# Altium project vesc.PrjPcb
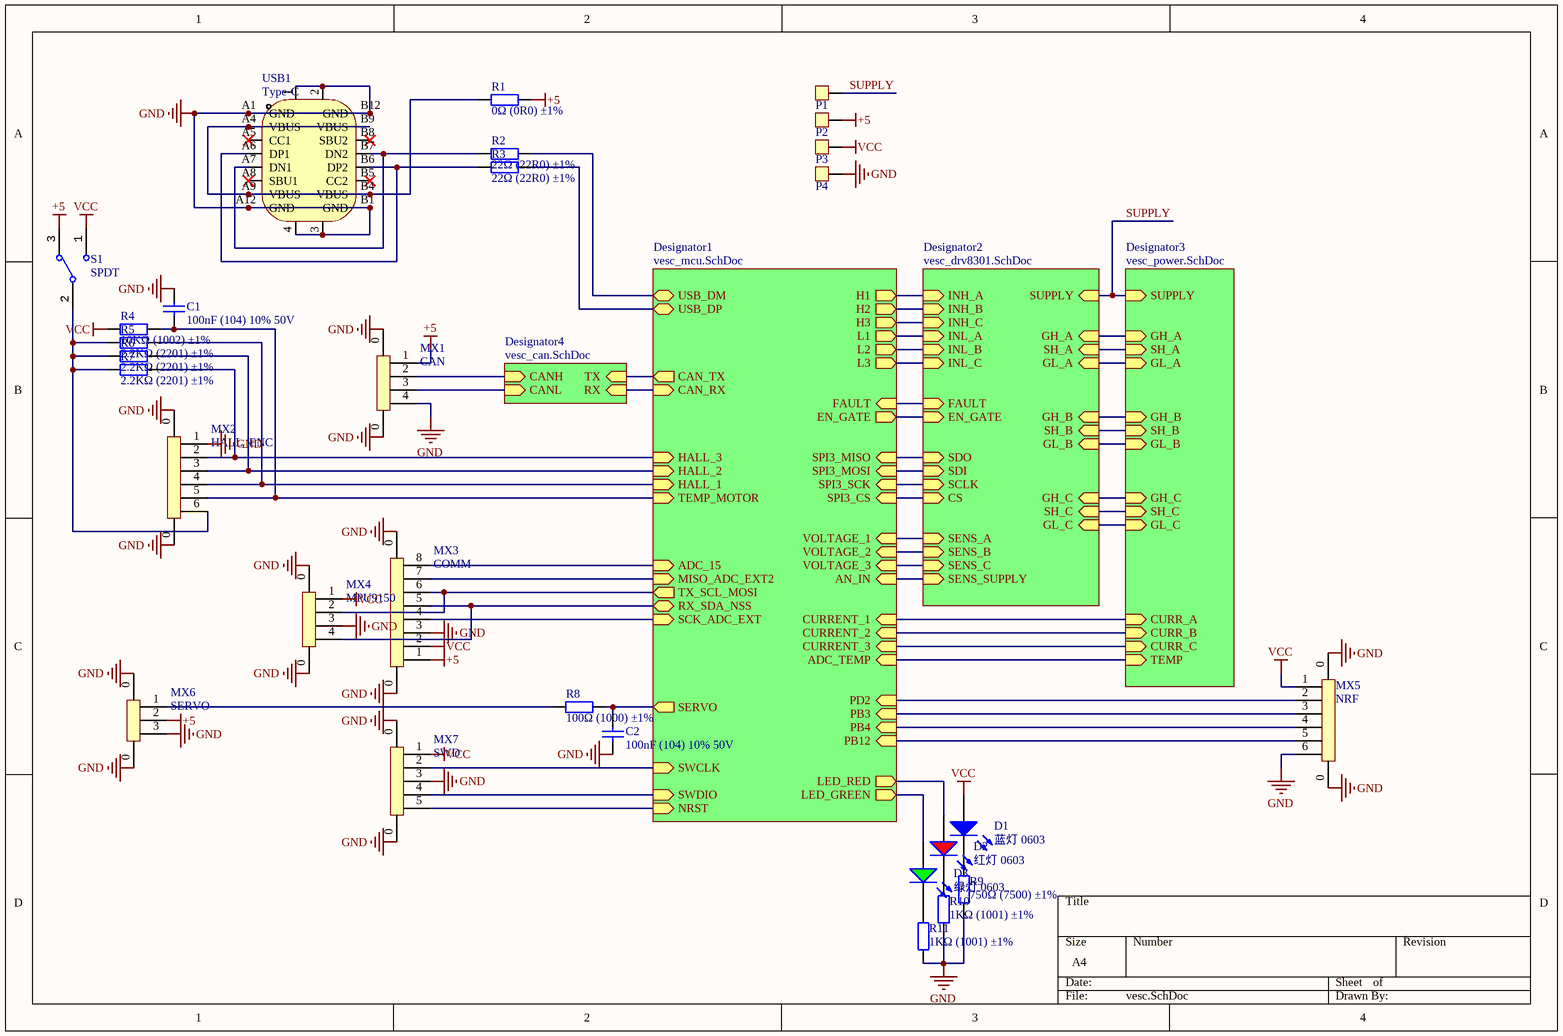
[diagram p0: vesc.SchDoc]
5 sheets, 127 parts. Net scope: hierarchical (ports join the sheet entries above them; power ports are global).
Board file: vesc.PcbDoc
Sheets:
  vesc.SchDoc
    Designator4 = vesc_can.SchDoc
    Designator1 = vesc_mcu.SchDoc
    Designator2 = vesc_drv8301.SchDoc
    Designator3 = vesc_power.SchDoc

## Sheet vesc.SchDoc
size A4; SheetNumber: 1; SheetTotal: 5

### Parts
C1  100nF (104) 10% 50V  [0603_C]
C2  100nF (104) 10% 50V  [0603_C]
D1  蓝灯 0603  [0603_LED_S1]
D2  红灯 0603  [0603_LED_S1]
D3  绿灯 0603  [0603_LED_S1]
MX1  CAN  [MX 1.25-WS-4P]
MX2  HALL_ENC  [MX 1.25-WS-6P]
MX3  COMM  [MX 1.25-WS-8P]
MX4  MPU9150  [MX 1.25-WS-4P]
MX5  NRF  [MX 1.25-WS-6P]
MX6  SERVO  [MX 1.25-WS-3P]
MX7  SWD  [MX 1.25-WS-5P]
P1  PAD  [PAD]  (value not drawn)
P2  PAD  [PAD]  (value not drawn)
P3  PAD  [PAD]  (value not drawn)
P4  PAD  [PAD]  (value not drawn)
R1  0Ω (0R0) ±1%  [0603_R]
R2  22Ω (22R0) ±1%  [0603_R]
R3  22Ω (22R0) ±1%  [0603_R]
R4  10KΩ (1002) ±1%  [0603_R]
R5  2.2KΩ (2201) ±1%  [0603_R]
R6  2.2KΩ (2201) ±1%  [0603_R]
R7  2.2KΩ (2201) ±1%  [0603_R]
R8  100Ω (1000) ±1%  [0603_R]
R9  750Ω (7500) ±1%  [0603_R]
R10  1KΩ (1001) ±1%  [0603_R]
R11  1KΩ (1001) ±1%  [0603_R]
S1  SPDT  [SwitchSPDT_4.3X8.6_D90]
USB1  Type-C  [TYPE-C_16P]

### Sub-sheets
Designator1 = vesc_mcu.SchDoc: NRST (in), VOLTAGE_1 (in), VOLTAGE_2 (in), VOLTAGE_3 (in), ADC_TEMP (in), RX_SDA_NSS (bidir), SCK_ADC_EXT (in), MISO_ADC_EXT2 (in), H1 (out), H2 (out), H3 (out), USB_DM (bidir), USB_DP (bidir), SWDIO (in), SWCLK (in), LED_GREEN (out), LED_RED (out), PB3 (in), PB4 (in), EN_GATE (out), SERVO (out), FAULT (in), CAN_RX (in), CAN_TX (out), PB12 (in), L1 (out), L2 (out), L3 (out), TX_SCL_MOSI (out), CURRENT_1 (in), CURRENT_2 (in), CURRENT_3 (in), AN_IN (in), TEMP_MOTOR (in), ADC_15 (in), HALL_1 (in), HALL_2 (in), HALL_3 (in), SPI3_CS (in), SPI3_SCK (in), SPI3_MISO (in), SPI3_MOSI (in), PD2 (in)
Designator2 = vesc_drv8301.SchDoc: SENS_SUPPLY (in), SUPPLY (in), SENS_A (in), SH_A (in), SENS_B (in), SENS_C (in), SH_C (in), FAULT (in), CS (in), SDI (in), SDO (in), SCLK (in), EN_GATE (in), INH_A (in), INL_A (in), INH_B (in), INL_B (in), INH_C (in), INL_C (in), GH_A (in), GL_A (in), GH_B (in), GL_B (in), GH_C (in), GL_C (in), SH_B (in)
Designator3 = vesc_power.SchDoc: GH_A (in), GL_A (in), SH_A (in), GH_B (in), GL_B (in), SH_B (in), GH_C (in), GL_C (in), SH_C (in), CURR_A (in), CURR_B (in), CURR_C (in), TEMP (in), SUPPLY (in)
Designator4 = vesc_can.SchDoc: TX (in), RX (in), CANH (in), CANL (in)

### Nets
+5: MX1.1 MX3.1 MX6.2 P2.1 R1.2 S1.3
GND: C1.2 C2.1 MX1.0 MX1.4 MX2.0 MX2.1 MX3.0 MX3.3 MX4.0 MX4.3 MX5.0 MX5.6 MX6.0 MX6.3 MX7.0 MX7.3 P4.1 R9.1 R10.1 R11.1 USB1.1 USB1.2 USB1.3 USB1.4 USB1.A1(GND) USB1.A12(GND) USB1.B1(GND) USB1.B12(GND)
VCC: D1.A MX3.2 MX4.1 MX5.1 MX7.1 P3.1 R4.1 S1.1
SH_A: sheet Designator2/SH_A, sheet Designator3/SH_A
SH_B: sheet Designator2/SH_B, sheet Designator3/SH_B
SH_C: sheet Designator2/SH_C, sheet Designator3/SH_C
SUPPLY: P1.1 ; sheet Designator2/SUPPLY, sheet Designator3/SUPPLY
NetC1_1: C1.1 MX2.5 R4.2 ; sheet Designator1/TEMP_MOTOR
NetC2_2: C2.2 R8.2 ; sheet Designator1/SERVO
NetC11_2: MX7.5 ; sheet Designator1/NRST
NetC42_2: sheet Designator1/CURRENT_1, sheet Designator3/CURR_A
NetC43_2: sheet Designator1/CURRENT_2, sheet Designator3/CURR_B
NetC46_2: sheet Designator1/ADC_TEMP, sheet Designator3/TEMP
NetC47_2: sheet Designator1/CURRENT_3, sheet Designator3/CURR_C
NetD1_K: D1.K R9.2
NetD2_A: D2.A ; sheet Designator1/LED_RED
NetD2_K: D2.K R10.2
NetD3_A: D3.A ; sheet Designator1/LED_GREEN
NetD3_K: D3.K R11.2
NetMX1_2: MX1.2 ; sheet Designator4/CANH
NetMX1_3: MX1.3 ; sheet Designator4/CANL
NetMX2_2: MX2.2 R7.2 ; sheet Designator1/HALL_3
NetMX2_3: MX2.3 R6.2 ; sheet Designator1/HALL_2
NetMX2_4: MX2.4 R5.2 ; sheet Designator1/HALL_1
NetMX2_6: MX2.6 R5.1 R6.1 R7.1 S1.2
NetMX3_4: MX3.4 ; sheet Designator1/SCK_ADC_EXT
NetMX3_5: MX3.5 MX4.4 ; sheet Designator1/RX_SDA_NSS
NetMX3_6: MX3.6 MX4.2 ; sheet Designator1/TX_SCL_MOSI
NetMX3_7: MX3.7 ; sheet Designator1/MISO_ADC_EXT2
NetMX3_8: MX3.8 ; sheet Designator1/ADC_15
NetMX5_2: MX5.2 ; sheet Designator1/PD2
NetMX5_3: MX5.3 ; sheet Designator1/PB3
NetMX5_4: MX5.4 ; sheet Designator1/PB4
NetMX5_5: MX5.5 ; sheet Designator1/PB12
NetMX6_1: MX6.1 R8.1
NetMX7_2: MX7.2 ; sheet Designator1/SWCLK
NetMX7_4: MX7.4 ; sheet Designator1/SWDIO
NetR1_1: R1.1 USB1.A4(VBUS) USB1.A9(VBUS) USB1.B4(VBUS) USB1.B9(VBUS)
NetR2_1: R2.1 USB1.A7(DN1) USB1.B7(DN2)
NetR2_2: R2.2 ; sheet Designator1/USB_DM
NetR3_1: R3.1 USB1.A6(DP1) USB1.B6(DP2)
NetR3_2: R3.2 ; sheet Designator1/USB_DP
NetR17_1: sheet Designator1/AN_IN, sheet Designator2/SENS_SUPPLY
NetR19_1: sheet Designator1/VOLTAGE_1, sheet Designator2/SENS_A
NetR21_1: sheet Designator1/VOLTAGE_2, sheet Designator2/SENS_B
NetR23_1: sheet Designator1/VOLTAGE_3, sheet Designator2/SENS_C
NetR26_1: sheet Designator2/GH_A, sheet Designator3/GH_A
NetR27_1: sheet Designator2/GH_C, sheet Designator3/GH_C
NetR28_1: sheet Designator2/GL_A, sheet Designator3/GL_A
NetR29_1: sheet Designator2/GL_C, sheet Designator3/GL_C
NetR34_1: sheet Designator2/GH_B, sheet Designator3/GH_B
NetR37_1: sheet Designator2/GL_B, sheet Designator3/GL_B
NetU1_34: sheet Designator1/L1, sheet Designator2/INL_A
NetU1_35: sheet Designator1/L2, sheet Designator2/INL_B
NetU1_36: sheet Designator1/L3, sheet Designator2/INL_C
NetU1_40: sheet Designator1/SPI3_CS, sheet Designator2/CS
NetU1_41: sheet Designator1/H1, sheet Designator2/INH_A
NetU1_42: sheet Designator1/H2, sheet Designator2/INH_B
NetU1_43: sheet Designator1/H3, sheet Designator2/INH_C
NetU1_51: sheet Designator1/SPI3_SCK, sheet Designator2/SCLK
NetU1_52: sheet Designator1/SPI3_MISO, sheet Designator2/SDO
NetU1_53: sheet Designator1/SPI3_MOSI, sheet Designator2/SDI
NetU1_57: sheet Designator1/EN_GATE, sheet Designator2/EN_GATE
NetU1_59: sheet Designator1/FAULT, sheet Designator2/FAULT
NetU1_61: sheet Designator4/RX, sheet Designator1/CAN_RX
NetU1_62: sheet Designator4/TX, sheet Designator1/CAN_TX

Not connected (* = marked no-connect by the designer): USB1 A5(CC1)* A8(SBU1)* B5(CC2)* B8(SBU2)*

### Library data of the parts
C1 C2 = 0603 100nF (104) 10% 50V: 贴片电容; ComponentLink1Description: 供应商链接; ComponentLink1URL: http://www.szlcsc.com/product/details_15331.html; Package: 0603; Supplier: LC; SuppliersPartNumber: C14663
D1 = 0603 蓝灯: 发光二极管; ComponentLink1Description: 供应商链接; ComponentLink1URL: http://www.szlcsc.com/product/details_73150.html; Package: 0603; Supplier: LC; SuppliersPartNumber: C72041
D2 = 0603 红灯: 发光二极管; ComponentLink1Description: 供应商链接; ComponentLink1URL: http://www.szlcsc.com/product/details_2659.html; Package: 0603; Supplier: LC; SuppliersPartNumber: C2286
D3 = 0603 绿灯: 发光二极管; ComponentLink1Description: 供应商链接; ComponentLink1URL: http://www.szlcsc.com/product/details_73152.html; Package: 0603; Supplier: LC; SuppliersPartNumber: C72043
MX1 MX4 = MX_WS_4P
MX2 MX5 = MX_WS_6P
MX3 = MX_WS_8P
MX6 = MX_WS_3P
MX7 = MX_WS_5P
P1-P4 = PAD: Manufacturer: AMASS(艾迈斯); Name: XT30U-M; Symbol: DC电源; Pin Type: IN; Add into BOM: yes; Device: XT30U-M; Convert to PCB: yes; Supplier Part: C99101; Supplier: LCSC; Manufacturer Part: XT30U-M; JLCPCB Part Class: 扩展库
R1 = 0603 0Ω (0R0) 1%: 贴片电阻; ComponentLink1Description: 供应商链接; ComponentLink1URL: http://www.szlcsc.com/product/details_21903.html; Package: 0603; Supplier: LC; SuppliersPartNumber: C21189
R2 R3 = 0603 22Ω (22R0) 1%: 贴片电阻; ComponentLink1Description: 供应商链接; ComponentLink1URL: http://www.szlcsc.com/product/details_24078.html; Package: 0603; Supplier: LC; SuppliersPartNumber: C23345
R4 = 0603 10KΩ (1002) 1%: 贴片电阻; ComponentLink1Description: 供应商链接; ComponentLink1URL: http://www.szlcsc.com/product/details_26547.html; Package: 0603; Supplier: LC; SuppliersPartNumber: C25804
R5-R7 = 0603 2.2KΩ (2201) 1%: 贴片电阻; ComponentLink1Description: 供应商链接; ComponentLink1URL: http://www.szlcsc.com/product/details_4597.html; Package: 0603; Supplier: LC; SuppliersPartNumber: C4190
R8 = 0603 100Ω (1000) 1%: 贴片电阻; ComponentLink1Description: 供应商链接; ComponentLink1URL: http://www.szlcsc.com/product/details_23502.html; Package: 0603; Supplier: LC; SuppliersPartNumber: C22775
R9 = 0603 750Ω (7500) 1%: 贴片电阻; ComponentLink1Description: 供应商链接; ComponentLink1URL: http://www.szlcsc.com/product/details_23968.html; Package: 0603; Supplier: LC; SuppliersPartNumber: C23241
R10 R11 = 0603 1KΩ (1001) 1%: 贴片电阻; ComponentLink1Description: 供应商链接; ComponentLink1URL: http://www.szlcsc.com/product/details_21904.html; Package: 0603; Supplier: LC; SuppliersPartNumber: C21190
S1 = SwitchSPDT_90DIP_4.3x8.6: Switch; Value: 4.2x8.6mm; Type: SPDT 3P
USB1 = USB-Type-C: USB-Type-C_16P

## Sheet vesc_can.SchDoc
size A4; SheetNumber: 4; SheetTotal: 5
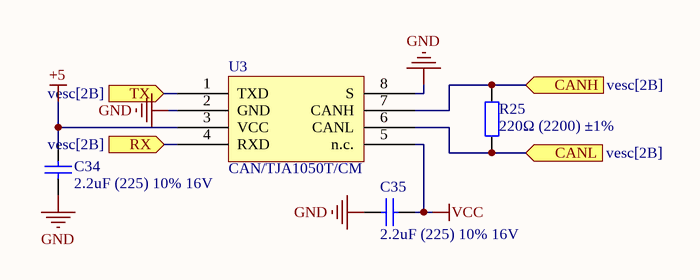
[diagram p1: vesc_can.SchDoc]

### Parts
C34  2.2uF (225) 10% 16V  [0603_C]
C35  2.2uF (225) 10% 16V  [0603_C]
R25  220Ω (2200) ±1%  [0603_R]
U3  CAN/TJA1050T/CM  [SOIC-8_150mil]

### Ports
CANH (in, see vesc[2B]), CANL (in, see vesc[2B]), RX (in, see vesc[2B]), TX (in, see vesc[2B])

### Nets
+5: C34.2 U3.3(VCC)
GND: C34.1 C35.1 U3.2(GND) U3.8(S)
VCC: C35.2 U3.5(n.c.)
NetMX1_2: R25.2 U3.7(CANH) ; port CANH
NetMX1_3: R25.1 U3.6(CANL) ; port CANL
NetU1_61: U3.4(RXD) ; port RX
NetU1_62: U3.1(TXD) ; port TX

### Library data of the parts
C34 C35 = 0603 2.2uF (225) 10% 16V: 贴片电容; ComponentLink1Description: 供应商链接; ComponentLink1URL: http://www.szlcsc.com/product/details_24366.html; Package: 0603; Supplier: LC; SuppliersPartNumber: C23630
R25 = 0603 220Ω (2200) 1%: 贴片电阻; ComponentLink1Description: 供应商链接; ComponentLink1URL: http://www.szlcsc.com/product/details_23689.html; Package: 0603; Supplier: LC; SuppliersPartNumber: C22962
U3 = CAN/TJA1050T/CM_[C6952]: CAN; ComponentLink1Description: 供应商链接; ComponentLink1URL: http://www.szlcsc.com/product/details_7424.html; Package: SOIC-8_150mil; Supplier: LC; SuppliersPartNumber: C6952

## Sheet vesc_mcu.SchDoc
size A4; SheetNumber: 2; SheetTotal: 5
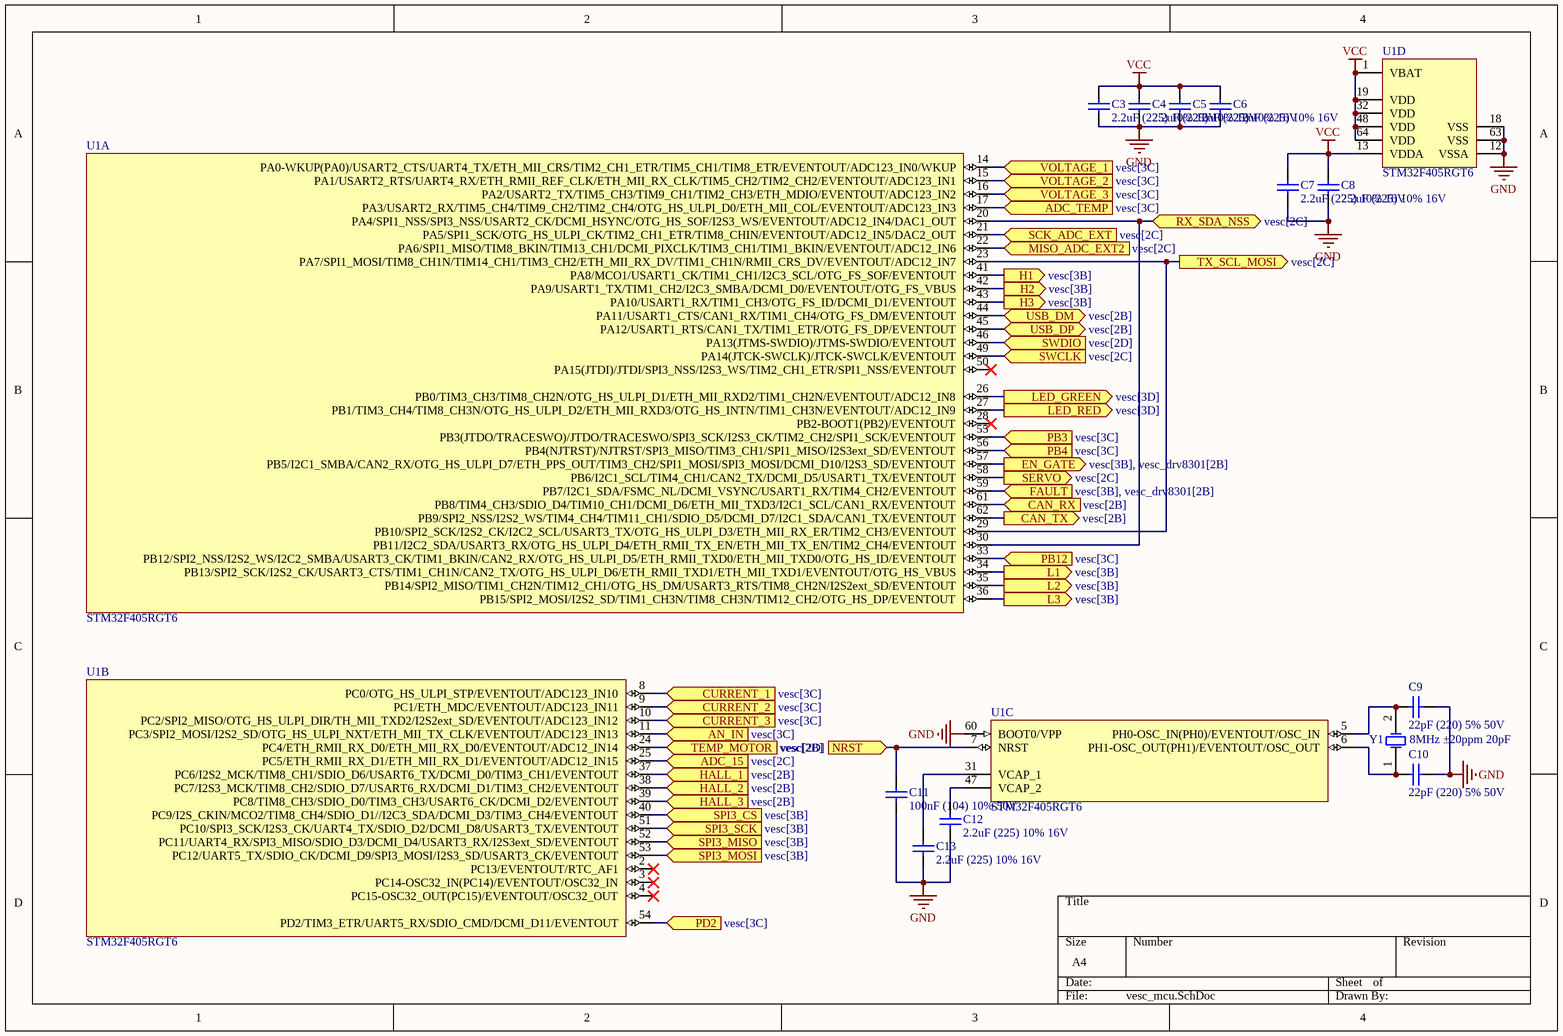
[diagram p2: vesc_mcu.SchDoc]

### Parts
C3  2.2uF (225) 10% 16V  [0603_C]
C4  2.2uF (225) 10% 16V  [0603_C]
C5  2.2uF (225) 10% 16V  [0603_C]
C6  2.2uF (225) 10% 16V  [0603_C]
C7  2.2uF (225) 10% 16V  [0603_C]
C8  2.2uF (225) 10% 16V  [0603_C]
C9  22pF (220) 5% 50V  [0603_C]
C10  22pF (220) 5% 50V  [0603_C]
C11  100nF (104) 10% 50V  [0603_C]
C12  2.2uF (225) 10% 16V  [0603_C]
C13  2.2uF (225) 10% 16V  [0603_C]
U1  STM32F405RGT6  [LQFP-64_10x10x05P]  (parts A,B,C,D of 4)
Y1  8MHz ±20ppm 20pF  [SMD-5032_2P]

### Ports
ADC_15 (in, see vesc[2C]), ADC_TEMP (in, see vesc[3C]), AN_IN (in, see vesc[3C]), CAN_RX (in, see vesc[2B]), CAN_TX (out, see vesc[2B]), CURRENT_1 (in, see vesc[3C]), CURRENT_2 (in, see vesc[3C]), CURRENT_3 (in, see vesc[3C]), EN_GATE (out, see vesc[3B], vesc_drv8301[2B]), FAULT (in, see vesc[3B], vesc_drv8301[2B]), H1 (out, see vesc[3B]), H2 (out, see vesc[3B]), H3 (out, see vesc[3B]), HALL_1 (in, see vesc[2B]), HALL_2 (in, see vesc[2B]), HALL_3 (in, see vesc[2B]), L1 (out, see vesc[3B]), L2 (out, see vesc[3B]), L3 (out, see vesc[3B]), LED_GREEN (out, see vesc[3D]), LED_RED (out, see vesc[3D]), MISO_ADC_EXT2 (in, see vesc[2C]), NRST (in, see vesc[2D]), PB3 (in, see vesc[3C]), PB4 (in, see vesc[3C]), PB12 (in, see vesc[3C]), PD2 (in, see vesc[3C]), RX_SDA_NSS (bidir, see vesc[2C]), SCK_ADC_EXT (in, see vesc[2C]), SERVO (out, see vesc[2C]), SPI3_CS (in, see vesc[3B]), SPI3_MISO (in, see vesc[3B]), SPI3_MOSI (in, see vesc[3B]), SPI3_SCK (in, see vesc[3B]), SWCLK (in, see vesc[2C]), SWDIO (in, see vesc[2D]), TEMP_MOTOR (in, see vesc[2B]), TX_SCL_MOSI (out, see vesc[2C]), USB_DM (bidir, see vesc[2B]), USB_DP (bidir, see vesc[2B]), VOLTAGE_1 (in, see vesc[3C]), VOLTAGE_2 (in, see vesc[3C]), VOLTAGE_3 (in, see vesc[3C])

### Nets
GND: C3.1 C4.1 C5.1 C6.1 C7.1 C8.1 C9.2 C10.2 C11.1 C12.1 C13.1 U1.12(VSSA) U1.18(VSS) U1.60(BOOT0/VPP) U1.63(VSS)
VCC: C3.2 C4.2 C5.2 C6.2 C7.2 C8.2 U1.1(VBAT) U1.13(VDDA) U1.19(VDD) U1.32(VDD) U1.48(VDD) U1.64(VDD)
NetC1_1: U1.24(PC4/ETH_RMII_RX_D0/ETH_MII_RX_D0/EVENTOUT/ADC12_IN14) ; port TEMP_MOTOR
NetC2_2: U1.58(PB6/I2C1_SCL/TIM4_CH1/CAN2_TX/DCMI_D5/USART1_TX/EVENTOUT) ; port SERVO
NetC9_1: C9.1 U1.5(PH0-OSC_IN(PH0)/EVENTOUT/OSC_IN) Y1.2(OSC2)
NetC10_1: C10.1 U1.6(PH1-OSC_OUT(PH1)/EVENTOUT/OSC_OUT) Y1.1(OSC1)
NetC11_2: C11.2 U1.7(NRST) ; port NRST
NetC12_2: C12.2 U1.47(VCAP_2)
NetC13_2: C13.2 U1.31(VCAP_1)
NetC42_2: U1.8(PC0/OTG_HS_ULPI_STP/EVENTOUT/ADC123_IN10) ; port CURRENT_1
NetC43_2: U1.9(PC1/ETH_MDC/EVENTOUT/ADC123_IN11) ; port CURRENT_2
NetC46_2: U1.17(PA3/USART2_RX/TIM5_CH4/TIM9_CH2/TIM2_CH4/OTG_HS_ULPI_D0/ETH_MII_COL/EVENTOUT/ADC123_IN3) ; port ADC_TEMP
NetC47_2: U1.10(PC2/SPI2_MISO/OTG_HS_ULPI_DIR/TH_MII_TXD2/I2S2ext_SD/EVENTOUT/ADC123_IN12) ; port CURRENT_3
NetD2_A: U1.27(PB1/TIM3_CH4/TIM8_CH3N/OTG_HS_ULPI_D2/ETH_MII_RXD3/OTG_HS_INTN/TIM1_CH3N/EVENTOUT/ADC12_IN9) ; port LED_RED
NetD3_A: U1.26(PB0/TIM3_CH3/TIM8_CH2N/OTG_HS_ULPI_D1/ETH_MII_RXD2/TIM1_CH2N/EVENTOUT/ADC12_IN8) ; port LED_GREEN
NetMX2_2: U1.39(PC8/TIM8_CH3/SDIO_D0/TIM3_CH3/USART6_CK/DCMI_D2/EVENTOUT) ; port HALL_3
NetMX2_3: U1.38(PC7/I2S3_MCK/TIM8_CH2/SDIO_D7/USART6_RX/DCMI_D1/TIM3_CH2/EVENTOUT) ; port HALL_2
NetMX2_4: U1.37(PC6/I2S2_MCK/TIM8_CH1/SDIO_D6/USART6_TX/DCMI_D0/TIM3_CH1/EVENTOUT) ; port HALL_1
NetMX3_4: U1.21(PA5/SPI1_SCK/OTG_HS_ULPI_CK/TIM2_CH1_ETR/TIM8_CHIN/EVENTOUT/ADC12_IN5/DAC2_OUT) ; port SCK_ADC_EXT
NetMX3_5: U1.20(PA4/SPI1_NSS/SPI3_NSS/USART2_CK/DCMI_HSYNC/OTG_HS_SOF/I2S3_WS/EVENTOUT/ADC12_IN4/DAC1_OUT) U1.30(PB11/I2C2_SDA/USART3_RX/OTG_HS_ULPI_D4/ETH_RMII_TX_EN/ETH_MII_TX_EN/TIM2_CH4/EVENTOUT) ; port RX_SDA_NSS
NetMX3_6: U1.23(PA7/SPI1_MOSI/TIM8_CH1N/TIM14_CH1/TIM3_CH2/ETH_MII_RX_DV/TIM1_CH1N/RMII_CRS_DV/EVENTOUT/ADC12_IN7) U1.29(PB10/SPI2_SCK/I2S2_CK/I2C2_SCL/USART3_TX/OTG_HS_ULPI_D3/ETH_MII_RX_ER/TIM2_CH3/EVENTOUT) ; port TX_SCL_MOSI
NetMX3_7: U1.22(PA6/SPI1_MISO/TIM8_BKIN/TIM13_CH1/DCMI_PIXCLK/TIM3_CH1/TIM1_BKIN/EVENTOUT/ADC12_IN6) ; port MISO_ADC_EXT2
NetMX3_8: U1.25(PC5/ETH_RMII_RX_D1/ETH_MII_RX_D1/EVENTOUT/ADC12_IN15) ; port ADC_15
NetMX5_2: U1.54(PD2/TIM3_ETR/UART5_RX/SDIO_CMD/DCMI_D11/EVENTOUT) ; port PD2
NetMX5_3: U1.55(PB3(JTDO/TRACESWO)/JTDO/TRACESWO/SPI3_SCK/I2S3_CK/TIM2_CH2/SPI1_SCK/EVENTOUT) ; port PB3
NetMX5_4: U1.56(PB4(NJTRST)/NJTRST/SPI3_MISO/TIM3_CH1/SPI1_MISO/I2S3ext_SD/EVENTOUT) ; port PB4
NetMX5_5: U1.33(PB12/SPI2_NSS/I2S2_WS/I2C2_SMBA/USART3_CK/TIM1_BKIN/CAN2_RX/OTG_HS_ULPI_D5/ETH_RMII_TXD0/ETH_MII_TXD0/OTG_HS_ID/EVENTOUT) ; port PB12
NetMX7_2: U1.49(PA14(JTCK-SWCLK)/JTCK-SWCLK/EVENTOUT) ; port SWCLK
NetMX7_4: U1.46(PA13(JTMS-SWDIO)/JTMS-SWDIO/EVENTOUT) ; port SWDIO
NetR2_2: U1.44(PA11/USART1_CTS/CAN1_RX/TIM1_CH4/OTG_FS_DM/EVENTOUT) ; port USB_DM
NetR3_2: U1.45(PA12/USART1_RTS/CAN1_TX/TIM1_ETR/OTG_FS_DP/EVENTOUT) ; port USB_DP
NetR17_1: U1.11(PC3/SPI2_MOSI/I2S2_SD/OTG_HS_ULPI_NXT/ETH_MII_TX_CLK/EVENTOUT/ADC123_IN13) ; port AN_IN
NetR19_1: U1.14(PA0-WKUP(PA0)/USART2_CTS/UART4_TX/ETH_MII_CRS/TIM2_CH1_ETR/TIM5_CH1/TIM8_ETR/EVENTOUT/ADC123_IN0/WKUP) ; port VOLTAGE_1
NetR21_1: U1.15(PA1/USART2_RTS/UART4_RX/ETH_RMII_REF_CLK/ETH_MII_RX_CLK/TIM5_CH2/TIM2_CH2/EVENTOUT/ADC123_IN1) ; port VOLTAGE_2
NetR23_1: U1.16(PA2/USART2_TX/TIM5_CH3/TIM9_CH1/TIM2_CH3/ETH_MDIO/EVENTOUT/ADC123_IN2) ; port VOLTAGE_3
NetU1_34: U1.34(PB13/SPI2_SCK/I2S2_CK/USART3_CTS/TIM1_CH1N/CAN2_TX/OTG_HS_ULPI_D6/ETH_RMII_TXD1/ETH_MII_TXD1/EVENTOUT/OTG_HS_VBUS) ; port L1
NetU1_35: U1.35(PB14/SPI2_MISO/TIM1_CH2N/TIM12_CH1/OTG_HS_DM/USART3_RTS/TIM8_CH2N/I2S2ext_SD/EVENTOUT) ; port L2
NetU1_36: U1.36(PB15/SPI2_MOSI/I2S2_SD/TIM1_CH3N/TIM8_CH3N/TIM12_CH2/OTG_HS_DP/EVENTOUT) ; port L3
NetU1_40: U1.40(PC9/I2S_CKIN/MCO2/TIM8_CH4/SDIO_D1//I2C3_SDA/DCMI_D3/TIM3_CH4/EVENTOUT) ; port SPI3_CS
NetU1_41: U1.41(PA8/MCO1/USART1_CK/TIM1_CH1/I2C3_SCL/OTG_FS_SOF/EVENTOUT) ; port H1
NetU1_42: U1.42(PA9/USART1_TX/TIM1_CH2/I2C3_SMBA/DCMI_D0/EVENTOUT/OTG_FS_VBUS) ; port H2
NetU1_43: U1.43(PA10/USART1_RX/TIM1_CH3/OTG_FS_ID/DCMI_D1/EVENTOUT) ; port H3
NetU1_51: U1.51(PC10/SPI3_SCK/I2S3_CK/UART4_TX/SDIO_D2/DCMI_D8/USART3_TX/EVENTOUT) ; port SPI3_SCK
NetU1_52: U1.52(PC11/UART4_RX/SPI3_MISO/SDIO_D3/DCMI_D4/USART3_RX/I2S3ext_SD/EVENTOUT) ; port SPI3_MISO
NetU1_53: U1.53(PC12/UART5_TX/SDIO_CK/DCMI_D9/SPI3_MOSI/I2S3_SD/USART3_CK/EVENTOUT) ; port SPI3_MOSI
NetU1_57: U1.57(PB5/I2C1_SMBA/CAN2_RX/OTG_HS_ULPI_D7/ETH_PPS_OUT/TIM3_CH2/SPI1_MOSI/SPI3_MOSI/DCMI_D10/I2S3_SD/EVENTOUT) ; port EN_GATE
NetU1_59: U1.59(PB7/I2C1_SDA/FSMC_NL/DCMI_VSYNC/USART1_RX/TIM4_CH2/EVENTOUT) ; port FAULT
NetU1_61: U1.61(PB8/TIM4_CH3/SDIO_D4/TIM10_CH1/DCMI_D6/ETH_MII_TXD3/I2C1_SCL/CAN1_RX/EVENTOUT) ; port CAN_RX
NetU1_62: U1.62(PB9/SPI2_NSS/I2S2_WS/TIM4_CH4/TIM11_CH1/SDIO_D5/DCMI_D7/I2C1_SDA/CAN1_TX/EVENTOUT) ; port CAN_TX

Not connected (* = marked no-connect by the designer): U1 2(PC13/EVENTOUT/RTC_AF1)* 3(PC14-OSC32_IN(PC14)/EVENTOUT/OSC32_IN)* 4(PC15-OSC32_OUT(PC15)/EVENTOUT/OSC32_OUT)* 28(PB2-BOOT1(PB2)/EVENTOUT)* 50(PA15(JTDI)/JTDI/SPI3_NSS/I2S3_WS/TIM2_CH1_ETR/SPI1_NSS/EVENTOUT)*

### Library data of the parts
C3-C8 C12 C13 = 0603 2.2uF (225) 10% 16V: 贴片电容; ComponentLink1Description: 供应商链接; ComponentLink1URL: http://www.szlcsc.com/product/details_24366.html; Package: 0603; Supplier: LC; SuppliersPartNumber: C23630
C9 C10 = 0603 22pF (220) 5% 50V: 贴片电容; ComponentLink1Description: 供应商链接; ComponentLink1URL: http://www.szlcsc.com/product/details_2005.html; Package: 0603; Supplier: LC; SuppliersPartNumber: C1653
C11 = 0603 100nF (104) 10% 50V: 贴片电容; ComponentLink1Description: 供应商链接; ComponentLink1URL: http://www.szlcsc.com/product/details_15331.html; Package: 0603; Supplier: LC; SuppliersPartNumber: C14663
U1 = STM32F405RGT6: ARM; ComponentLink1Description: 供应商链接; ComponentLink1URL: http://www.szlcsc.com/product/details_16424.html; Package: LQFP-64_10x10x05P; Supplier: LC; SuppliersPartNumber: C15742
Y1 = SMD-5032_2P 8MHz 20ppm 20pF: 贴片晶振; ComponentLink1Description: 供应商链接; ComponentLink1URL: http://www.szlcsc.com/product/details_117214.html; Package: SMD-5032_2P; Supplier: LC; SuppliersPartNumber: C115962

## Sheet vesc_drv8301.SchDoc
size A4; SheetNumber: 3; SheetTotal: 5
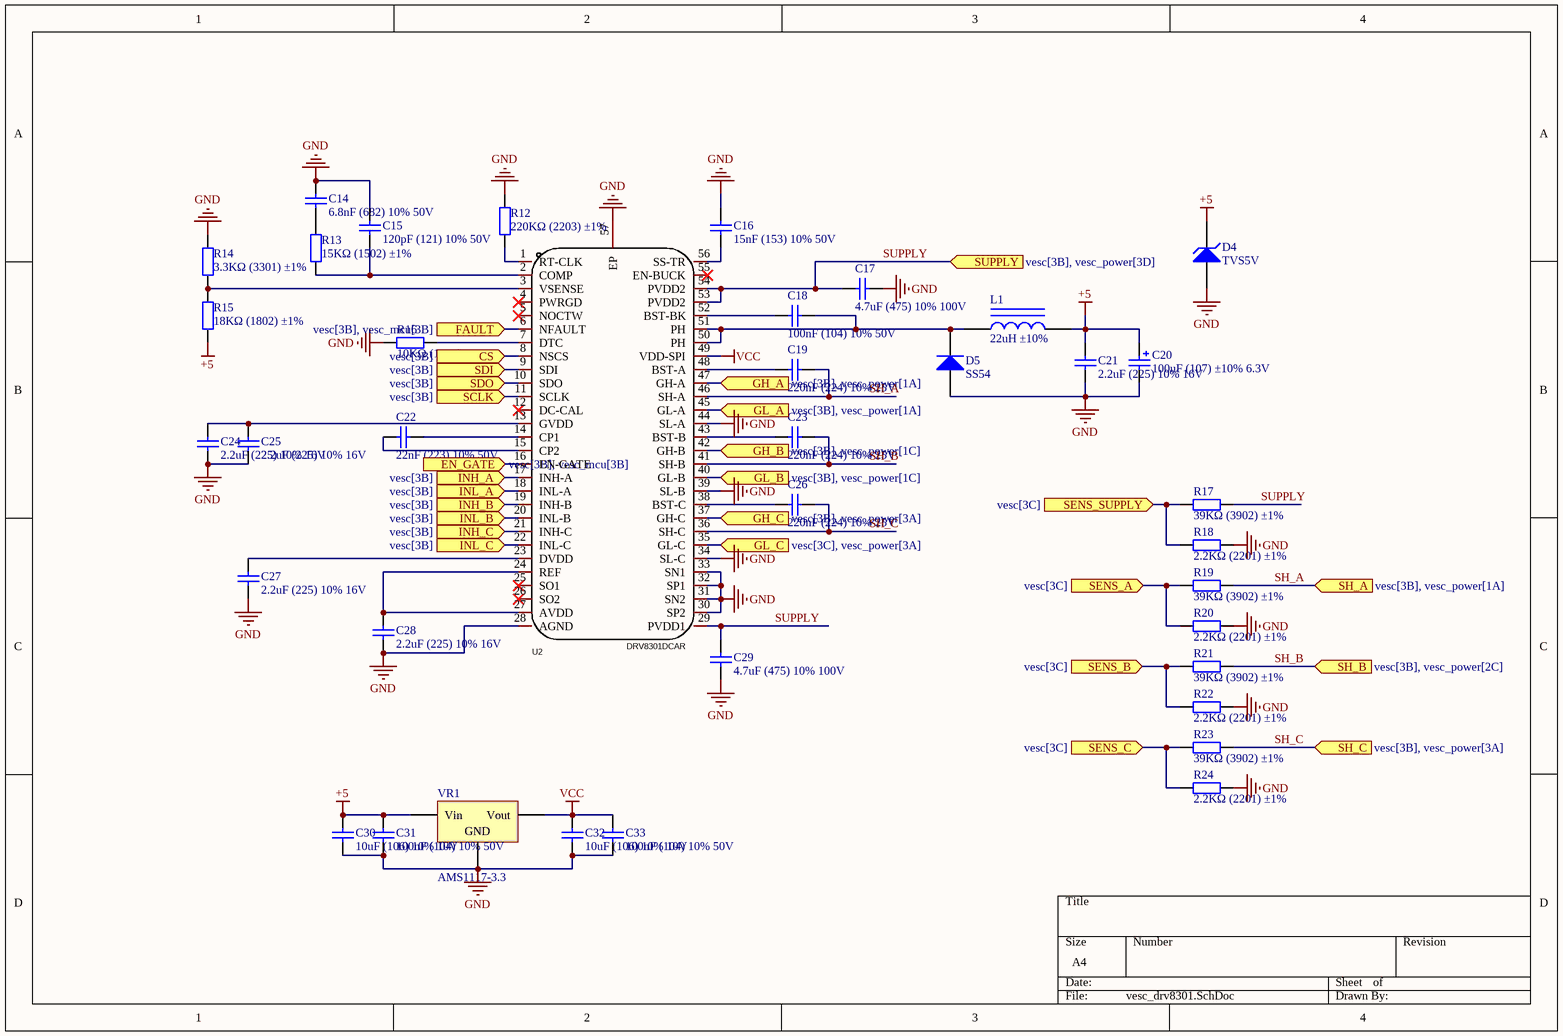
[diagram p3: vesc_drv8301.SchDoc]

### Parts
C14  6.8nF (682) 10% 50V  [0603_C]
C15  120pF (121) 10% 50V  [0603_C]
C16  15nF (153) 10% 50V  [0603_C]
C17  4.7uF (475) 10% 100V  [1210_C]
C18  100nF (104) 10% 50V  [0603_C]
C19  220nF (224) 10% 25V  [0603_C]
C20  100uF (107) ±10% 6.3V  [CASE-B_3528]
C21  2.2uF (225) 10% 16V  [0603_C]
C22  22nF (223) 10% 50V  [0603_C]
C23  220nF (224) 10% 25V  [0603_C]
C24  2.2uF (225) 10% 16V  [0603_C]
C25  2.2uF (225) 10% 16V  [0603_C]
C26  220nF (224) 10% 25V  [0603_C]
C27  2.2uF (225) 10% 16V  [0603_C]
C28  2.2uF (225) 10% 16V  [0603_C]
C29  4.7uF (475) 10% 100V  [1210_C]
C30  10uF (106) 10% 10V  [0603_C]
C31  100nF (104) 10% 50V  [0603_C]
C32  10uF (106) 10% 10V  [0603_C]
C33  100nF (104) 10% 50V  [0603_C]
D4  TVS5V  [SMA(DO-214AC)_S2]
D5  SS54  [SMA(DO-214AC)_S1]
L1  22uH ±10%  [IND-SMD_L7.3-W6.6]
R12  220KΩ (2203) ±1%  [0603_R]
R13  15KΩ (1502) ±1%  [0603_R]
R14  3.3KΩ (3301) ±1%  [0603_R]
R15  18KΩ (1802) ±1%  [0603_R]
R16  10KΩ (1002) ±1%  [0603_R]
R17  39KΩ (3902) ±1%  [0603_R]
R18  2.2KΩ (2201) ±1%  [0603_R]
R19  39KΩ (3902) ±1%  [0603_R]
R20  2.2KΩ (2201) ±1%  [0603_R]
R21  39KΩ (3902) ±1%  [0603_R]
R22  2.2KΩ (2201) ±1%  [0603_R]
R23  39KΩ (3902) ±1%  [0603_R]
R24  2.2KΩ (2201) ±1%  [0603_R]
U2  DRV8301DCAR  [HTSSOP-56_L14.0-W6.0-P0.50-LS8.0-BL]
VR1  AMS1117-3.3  [SOT-223]

### Ports
CS (in, see vesc[3B]), EN_GATE (in, see vesc[3B], vesc_mcu[3B]), FAULT (in, see vesc[3B], vesc_mcu[3B]), GH_A (in, see vesc[3B], vesc_power[1A]), GH_B (in, see vesc[3B], vesc_power[1C]), GH_C (in, see vesc[3B], vesc_power[3A]), GL_A (in, see vesc[3B], vesc_power[1A]), GL_B (in, see vesc[3B], vesc_power[1C]), GL_C (in, see vesc[3C], vesc_power[3A]), INH_A (in, see vesc[3B]), INH_B (in, see vesc[3B]), INH_C (in, see vesc[3B]), INL_A (in, see vesc[3B]), INL_B (in, see vesc[3B]), INL_C (in, see vesc[3B]), SCLK (in, see vesc[3B]), SDI (in, see vesc[3B]), SDO (in, see vesc[3B]), SENS_A (in, see vesc[3C]), SENS_B (in, see vesc[3C]), SENS_C (in, see vesc[3C]), SENS_SUPPLY (in, see vesc[3C]), SH_A (in, see vesc[3B], vesc_power[1A]), SH_B (in, see vesc[3B], vesc_power[2C]), SH_C (in, see vesc[3B], vesc_power[3A]), SUPPLY (in, see vesc[3B], vesc_power[3D])

### Nets
+5: C20.1 C21.2 C30.2 C31.2 D4.2(K) L1.2 R15.1 VR1.3(Vin)
GND: C14.2 C15.2 C16.2 C17.2 C20.2 C21.1 C24.1 C25.1 C27.1 C28.1 C29.1 C30.1 C31.1 C32.1 C33.1 D4.1(A) D5.1(A) R12.2 R14.2 R16.1 R18.2 R20.2 R22.2 R24.2 U2.28(AGND) U2.30(SP2) U2.31(SN2) U2.32(SP1) U2.33(SN1) U2.34(SL-C) U2.39(SL-B) U2.44(SL-A) U2.57(EP) VR1.1(GND)
VCC: C32.2 C33.2 U2.49(VDD-SPI) VR1.2(Vout)
SH_A: C19.2 R19.2 U2.46(SH-A) ; port SH_A
SH_B: C23.2 R21.2 U2.41(SH-B) ; port SH_B
SH_C: C26.2 R23.2 U2.36(SH-C) ; port SH_C
SUPPLY: C17.1 C29.2 R17.2 U2.29(PVDD1) U2.53(PVDD2) U2.54(PVDD2) ; port SUPPLY
NetC14_1: C14.1 R13.2
NetC15_1: C15.1 R13.1 U2.2(COMP)
NetC16_1: C16.1 U2.56(SS-TR)
NetC18_1: C18.1 U2.52(BST-BK)
NetC18_2: C18.2 D5.2(K) L1.1 U2.50(PH) U2.51(PH)
NetC19_1: C19.1 U2.48(BST-A)
NetC22_1: C22.1 U2.15(CP2)
NetC22_2: C22.2 U2.14(CP1)
NetC23_1: C23.1 U2.43(BST-B)
NetC24_2: C24.2 C25.2 U2.13(GVDD)
NetC26_1: C26.1 U2.38(BST-C)
NetC27_2: C27.2 U2.23(DVDD)
NetC28_2: C28.2 U2.24(REF) U2.27(AVDD)
NetR12_1: R12.1 U2.1(RT-CLK)
NetR14_1: R14.1 R15.2 U2.3(VSENSE)
NetR16_2: R16.2 U2.7(DTC)
NetR17_1: R17.1 R18.1 ; port SENS_SUPPLY
NetR19_1: R19.1 R20.1 ; port SENS_A
NetR21_1: R21.1 R22.1 ; port SENS_B
NetR23_1: R23.1 R24.1 ; port SENS_C
NetR26_1: U2.47(GH-A) ; port GH_A
NetR27_1: U2.37(GH-C) ; port GH_C
NetR28_1: U2.45(GL-A) ; port GL_A
NetR29_1: U2.35(GL-C) ; port GL_C
NetR34_1: U2.42(GH-B) ; port GH_B
NetR37_1: U2.40(GL-B) ; port GL_B
NetU1_34: U2.18(INL-A) ; port INL_A
NetU1_35: U2.20(INL-B) ; port INL_B
NetU1_36: U2.22(INL-C) ; port INL_C
NetU1_40: U2.8(NSCS) ; port CS
NetU1_41: U2.17(INH-A) ; port INH_A
NetU1_42: U2.19(INH-B) ; port INH_B
NetU1_43: U2.21(INH-C) ; port INH_C
NetU1_51: U2.11(SCLK) ; port SCLK
NetU1_52: U2.10(SDO) ; port SDO
NetU1_53: U2.9(SDI) ; port SDI
NetU1_57: U2.16(EN-GATE) ; port EN_GATE
NetU1_59: U2.6(NFAULT) ; port FAULT

Not connected (* = marked no-connect by the designer): U2 4(PWRGD)* 5(NOCTW)* 12(DC-CAL)* 25(SO1)* 26(SO2)* 55(EN-BUCK)*

### Library data of the parts
C14 = 0603 6.8nF (682) 10% 50V: 贴片电容; ComponentLink1Description: 供应商链接; ComponentLink1URL: http://www.szlcsc.com/product/details_1983.html; Package: 0603; Supplier: LC; SuppliersPartNumber: C1631
C15 = 0603 150pF (151) 10% 50V: 贴片电容; ComponentLink1Description: 供应商链接; ComponentLink1URL: http://www.szlcsc.com/product/details_1946.html; Package: 0603; Supplier: LC; SuppliersPartNumber: C1594
C16 = 0603 15nF (153) 10% 50V: 贴片电容; ComponentLink1Description: 供应商链接; ComponentLink1URL: http://www.szlcsc.com/product/details_1948.html; Package: 0603; Supplier: LC; SuppliersPartNumber: C1596
C17 C29 = 1206 4.7uF (475) 10% 50V: 贴片电容; ComponentLink1Description: 供应商链接; ComponentLink1URL: http://www.szlcsc.com/product/details_30577.html; Package: 1206; Supplier: LC; SuppliersPartNumber: C29823
C18 C31 C33 = 0603 100nF (104) 10% 50V: 贴片电容; ComponentLink1Description: 供应商链接; ComponentLink1URL: http://www.szlcsc.com/product/details_15331.html; Package: 0603; Supplier: LC; SuppliersPartNumber: C14663
C19 C23 C26 = 0603 220nF (224) 10% 25V: 贴片电容; ComponentLink1Description: 供应商链接; ComponentLink1URL: http://www.szlcsc.com/product/details_21832.html; Package: 0603; Supplier: LC; SuppliersPartNumber: C21120
C20 = 3528 100uF (107) 10% 6.3V: 钽电容; ComponentLink1Description: 供应商链接; ComponentLink1URL: http://www.szlcsc.com/product/details_16815.html; Package: 3528; Supplier: LC; SuppliersPartNumber: C16133
C21 C24 C25 C27 C28 = 0603 2.2uF (225) 10% 16V: 贴片电容; ComponentLink1Description: 供应商链接; ComponentLink1URL: http://www.szlcsc.com/product/details_24366.html; Package: 0603; Supplier: LC; SuppliersPartNumber: C23630
C22 = 0603 22nF (223) 10% 50V: 贴片电容; ComponentLink1Description: 供应商链接; ComponentLink1URL: http://www.szlcsc.com/product/details_21834.html; Package: 0603; Supplier: LC; SuppliersPartNumber: C21122
C30 C32 = 0603 10uF (106) 10% 10V: 贴片电容; ComponentLink1Description: 供应商链接; ComponentLink1URL: http://www.szlcsc.com/product/details_20411.html; Package: 0603; Supplier: LC; SuppliersPartNumber: C19702
D4 = LL-34 ZMM5V6: 稳压二极管; ComponentLink1Description: 供应商链接; ComponentLink1URL: http://www.szlcsc.com/product/details_8541.html; Package: LL-34; Supplier: LC; SuppliersPartNumber: C8062
D5 = SMA(DO-214AC) SS54: 二极管; ComponentLink1Description: 供应商链接; ComponentLink1URL: http://www.szlcsc.com/product/details_23178.html; Package: SMA(DO-214AC); Supplier: LC; SuppliersPartNumber: C22452
L1 = 0805 22uH 10%: 贴片电感; ComponentLink1Description: 供应商链接; ComponentLink1URL: http://www.szlcsc.com/product/details_33340.html; Package: 0805; Supplier: LC; SuppliersPartNumber: C32375
R12 = 0603 220KΩ (2203) 1%: 贴片电阻; ComponentLink1Description: 供应商链接; ComponentLink1URL: http://www.szlcsc.com/product/details_23688.html; Package: 0603; Supplier: LC; SuppliersPartNumber: C22961
R13 = 0603 15KΩ (1502) 1%: 贴片电阻; ComponentLink1Description: 供应商链接; ComponentLink1URL: http://www.szlcsc.com/product/details_23536.html; Package: 0603; Supplier: LC; SuppliersPartNumber: C22809
R14 = 0603 3.3KΩ (3301) 1%: 贴片电阻; ComponentLink1Description: 供应商链接; ComponentLink1URL: http://www.szlcsc.com/product/details_23705.html; Package: 0603; Supplier: LC; SuppliersPartNumber: C22978
R15 = 0603 18KΩ (1802) 1%: 贴片电阻; ComponentLink1Description: 供应商链接; ComponentLink1URL: http://www.szlcsc.com/product/details_26553.html; Package: 0603; Supplier: LC; SuppliersPartNumber: C25810
R16 = 0603 10KΩ (1002) 1%: 贴片电阻; ComponentLink1Description: 供应商链接; ComponentLink1URL: http://www.szlcsc.com/product/details_26547.html; Package: 0603; Supplier: LC; SuppliersPartNumber: C25804
R17 R19 R21 R23 = 0603 39KΩ (3902) 1%: 贴片电阻; ComponentLink1Description: 供应商链接; ComponentLink1URL: http://www.szlcsc.com/product/details_23880.html; Package: 0603; Supplier: LC; SuppliersPartNumber: C23153
R18 R20 R22 R24 = 0603 2.2KΩ (2201) 1%: 贴片电阻; ComponentLink1Description: 供应商链接; ComponentLink1URL: http://www.szlcsc.com/product/details_4597.html; Package: 0603; Supplier: LC; SuppliersPartNumber: C4190
U2 = DRV8301DCAR: Manufacturer: TI(德州仪器); Add into BOM: yes; Name: DRV8301DCAR; Symbol: DRV8301DCAR; Device: DRV8301DCAR; LCSC Part Name: 无刷直流BLDC电机驱动芯片 60V; Supplier Part: C98969; Manufacturer Part: DRV8301DCAR; Supplier Footprint: HTSSOP-56-6mm; JLCPCB Part Class: Extended Part; Datasheet: https://www.ti.com/cn/lit/gpn/drv8301; Supplier: LCSC; Convert to PCB: yes
VR1 = SOT-223 AMS1117-3.3: 低压差线性稳压(LDO); ComponentLink1Description: 供应商链接; ComponentLink1URL: http://www.szlcsc.com/product/details_6652.html; Package: SOT-223; Supplier: LC; SuppliersPartNumber: C6186

## Sheet vesc_power.SchDoc
size A4; SheetNumber: 5; SheetTotal: 5
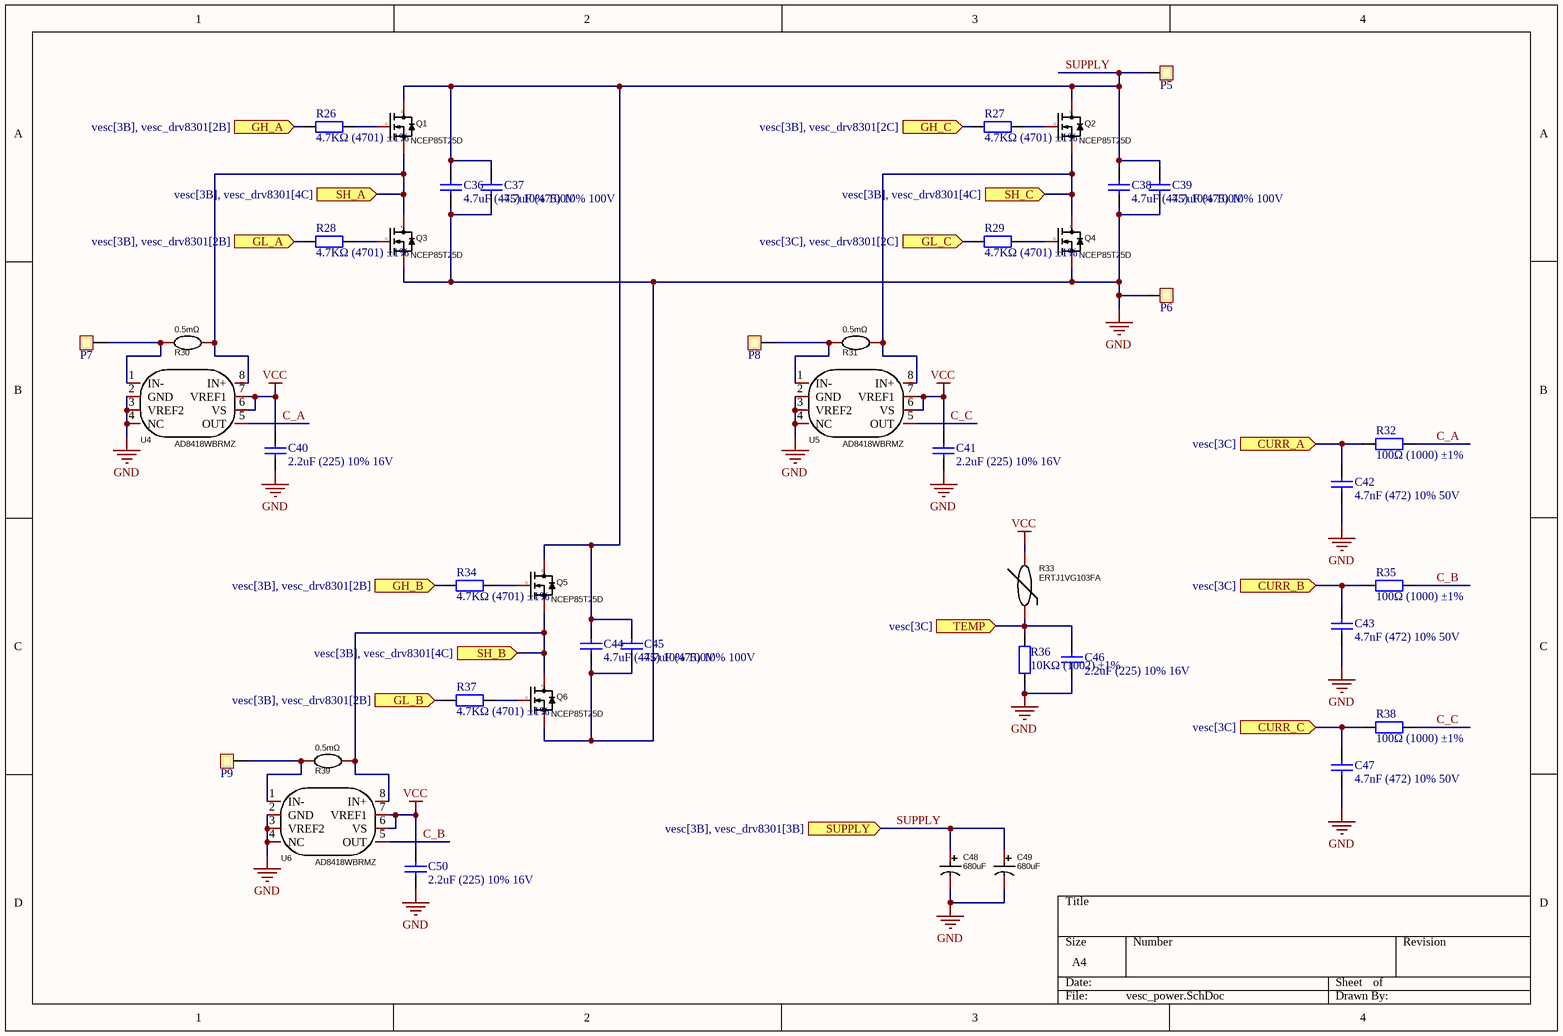
[diagram p4: vesc_power.SchDoc]

### Parts
C36  4.7uF (475) 10% 100V  [1210_C]
C37  4.7uF (475) 10% 100V  [1210_C]
C38  4.7uF (475) 10% 100V  [1210_C]
C39  4.7uF (475) 10% 100V  [1210_C]
C40  2.2uF (225) 10% 16V  [0603_C]
C41  2.2uF (225) 10% 16V  [0603_C]
C42  4.7nF (472) 10% 50V  [0603_C]
C43  4.7nF (472) 10% 50V  [0603_C]
C44  4.7uF (475) 10% 100V  [1210_C]
C45  4.7uF (475) 10% 100V  [1210_C]
C46  2.2uF (225) 10% 16V  [0603_C]
C47  4.7nF (472) 10% 50V  [0603_C]
C48  680uF  [CAP-TH_BD12.5-P5.00-D0.6-FD]
C49  680uF  [CAP-TH_BD12.5-P5.00-D0.6-FD]
C50  2.2uF (225) 10% 16V  [0603_C]
P5  PAD  [PAD]  (value not drawn)
P6  PAD  [PAD]  (value not drawn)
P7  PAD  [PAD]  (value not drawn)
P8  PAD  [PAD]  (value not drawn)
P9  PAD  [PAD]  (value not drawn)
Q1  NCEP85T25D  [TO-263-2_L10.0-W9.1-P5.08-LS15.2-TL]
Q2  NCEP85T25D  [TO-263-2_L10.0-W9.1-P5.08-LS15.2-TL]
Q3  NCEP85T25D  [TO-263-2_L10.0-W9.1-P5.08-LS15.2-TL]
Q4  NCEP85T25D  [TO-263-2_L10.0-W9.1-P5.08-LS15.2-TL]
Q5  NCEP85T25D  [TO-263-2_L10.0-W9.1-P5.08-LS15.2-TL]
Q6  NCEP85T25D  [TO-263-2_L10.0-W9.1-P5.08-LS15.2-TL]
R26  4.7KΩ (4701) ±1%  [0603_R]
R27  4.7KΩ (4701) ±1%  [0603_R]
R28  4.7KΩ (4701) ±1%  [0603_R]
R29  4.7KΩ (4701) ±1%  [0603_R]
R30  0.5mΩ  [R3920]
R31  0.5mΩ  [R3920]
R32  100Ω (1000) ±1%  [0603_R]
R33  ERTJ1VG103FA  [R0603]
R34  4.7KΩ (4701) ±1%  [0603_R]
R35  100Ω (1000) ±1%  [0603_R]
R36  10KΩ (1002) ±1%  [0603_R]
R37  4.7KΩ (4701) ±1%  [0603_R]
R38  100Ω (1000) ±1%  [0603_R]
R39  0.5mΩ  [R3920]
U4  AD8418WBRMZ  [MSOP-8_L3.0-W3.0-P0.65-LS5.0-BL]
U5  AD8418WBRMZ  [MSOP-8_L3.0-W3.0-P0.65-LS5.0-BL]
U6  AD8418WBRMZ  [MSOP-8_L3.0-W3.0-P0.65-LS5.0-BL]

### Ports
CURR_A (in, see vesc[3C]), CURR_B (in, see vesc[3C]), CURR_C (in, see vesc[3C]), GH_A (in, see vesc[3B], vesc_drv8301[2B]), GH_B (in, see vesc[3B], vesc_drv8301[2B]), GH_C (in, see vesc[3B], vesc_drv8301[2C]), GL_A (in, see vesc[3B], vesc_drv8301[2B]), GL_B (in, see vesc[3B], vesc_drv8301[2B]), GL_C (in, see vesc[3C], vesc_drv8301[2C]), SH_A (in, see vesc[3B], vesc_drv8301[4C]), SH_B (in, see vesc[3B], vesc_drv8301[4C]), SH_C (in, see vesc[3B], vesc_drv8301[4C]), SUPPLY (in, see vesc[3B], vesc_drv8301[3B]), TEMP (in, see vesc[3C])

### Nets
GND: C36.1 C37.1 C38.1 C39.1 C40.1 C41.1 C42.1 C43.1 C44.1 C45.1 C46.1 C47.1 C48.2 C49.2 C50.1 P6.1 Q3.3(S) Q4.3(S) Q6.3(S) R36.1 U4.2(GND) U4.3(VREF2) U4.4(NC) U5.2(GND) U5.3(VREF2) U5.4(NC) U6.2(GND) U6.3(VREF2) U6.4(NC)
VCC: C40.2 C41.2 C50.2 R33.2 U4.6(VS) U4.7(VREF1) U5.6(VS) U5.7(VREF1) U6.6(VS) U6.7(VREF1)
C_A: R32.2 U4.5(OUT)
C_B: R35.2 U6.5(OUT)
C_C: R38.2 U5.5(OUT)
SH_A: Q1.3(S) Q3.4(D) R30.2 U4.8(IN+) ; port SH_A
SH_B: Q5.3(S) Q6.4(D) R39.2 U6.8(IN+) ; port SH_B
SH_C: Q2.3(S) Q4.4(D) R31.2 U5.8(IN+) ; port SH_C
SUPPLY: C36.2 C37.2 C38.2 C39.2 C44.2 C45.2 C48.1 C49.1 P5.1 Q1.4(D) Q2.4(D) Q5.4(D) ; port SUPPLY
NetC42_2: C42.2 R32.1 ; port CURR_A
NetC43_2: C43.2 R35.1 ; port CURR_B
NetC46_2: C46.2 R33.1 R36.2 ; port TEMP
NetC47_2: C47.2 R38.1 ; port CURR_C
NetP7_1: P7.1 R30.1 U4.1(IN-)
NetP8_1: P8.1 R31.1 U5.1(IN-)
NetP9_1: P9.1 R39.1 U6.1(IN-)
NetQ1_1: Q1.1(G) R26.2
NetQ2_1: Q2.1(G) R27.2
NetQ3_1: Q3.1(G) R28.2
NetQ4_1: Q4.1(G) R29.2
NetQ5_1: Q5.1(G) R34.2
NetQ6_1: Q6.1(G) R37.2
NetR26_1: R26.1 ; port GH_A
NetR27_1: R27.1 ; port GH_C
NetR28_1: R28.1 ; port GL_A
NetR29_1: R29.1 ; port GL_C
NetR34_1: R34.1 ; port GH_B
NetR37_1: R37.1 ; port GL_B

### Library data of the parts
C36-C39 C44 C45 = 1206 4.7uF (475) 10% 50V: 贴片电容; ComponentLink1Description: 供应商链接; ComponentLink1URL: http://www.szlcsc.com/product/details_30577.html; Package: 1206; Supplier: LC; SuppliersPartNumber: C29823
C40 C41 C46 C50 = 0603 2.2uF (225) 10% 16V: 贴片电容; ComponentLink1Description: 供应商链接; ComponentLink1URL: http://www.szlcsc.com/product/details_24366.html; Package: 0603; Supplier: LC; SuppliersPartNumber: C23630
C42 C43 C47 = 0603 4.7nF (472) 10% 50V: 贴片电容; ComponentLink1Description: 供应商链接; ComponentLink1URL: http://www.szlcsc.com/product/details_55004.html; Package: 0603; Supplier: LC; SuppliersPartNumber: C53987
C48 C49 = ERR1JM681W25OT: Manufacturer: AISHI(艾华集团); Add into BOM: yes; Tolerance: ±20%; Rated Voltage: 63V; φD: 12.5mm; L: 25mm; Lifetime @ Temp: 2000hrs@105℃; Name: 680uF; Symbol: ERR1JM681W25OT; Device: ERR1JM681W25OT; LCSC Part Name: 680uF ±20% 63V; Supplier Part: C106632; Manufacturer Part: ERR1JM681W25OT; Supplier Footprint: 插件,D12.5xL25mm; JLCPCB Part Class: Extended Part; Datasheet: https://atta.szlcsc.com/upload/public/pdf/source/20190702/C401591_1676EF45BC9A88BD1D6B22BBAE3913C7.pdf; Supplier: LCSC; Convert to PCB: yes; Value: 680uF; Lead Spacing: 5mm
P5-P9 = PAD: as P1 on sheet vesc; Device: XT30U-M; Convert to PCB: yes; Supplier Part: C99101; Supplier: LCSC; Manufacturer Part: XT30U-M; JLCPCB Part Class: 扩展库
Q1-Q6 = NCEP85T25D: Manufacturer: NCE(无锡新洁能); Add into BOM: yes; Type: N沟道; Drain Source Voltage (Vdss): 85V; Continuous Drain Current (Id): 250A; Power Dissipation (Pd): 300W; Drain Source On Resistance (RDS(on)@Vgs,Id): 2.6mΩ@10V,100A; Gate Threshold Voltage (Vgs(th)@Id): 4.5V@250uA; Name: NCEP85T25D; Symbol: NCEP85T25D; Device: NCEP85T25D; LCSC Part Name: N沟道 耐压:85V 电流:250A; Supplier Part: C181921; Manufacturer Part: NCEP85T25D; Supplier Footprint: TO-263-2; JLCPCB Part Class: Extended Part; Datasheet: https://atta.szlcsc.com/upload/public/pdf/source/20180131/C181921_15173932479761329348.pdf; Supplier: LCSC; Convert to PCB: yes
R26-R29 R34 R37 = 0603 4.7KΩ (4701) 1%: 贴片电阻; ComponentLink1Description: 供应商链接; ComponentLink1URL: http://www.szlcsc.com/product/details_23889.html; Package: 0603; Supplier: LC; SuppliersPartNumber: C23162
R30 R31 R39 = ASR-M-5-0.5F: Manufacturer: yezhan(业展); Add into BOM: yes; Tolerance: ±1%; Power(Watts): 9W; Temperature Coefficient: ±70ppm/℃; Mounting Sytle: 贴片; Name: 0.5mΩ; Symbol: ASR-M-5-0.5F; Device: ASR-M-5-0.5F; LCSC Part Name: 0.5mΩ ±1% 9W; Supplier Part: C469433; Manufacturer Part: ASR-M-5-0.5F; Supplier Footprint: 3920; JLCPCB Part Class: Extended Part; Datasheet: https://atta.szlcsc.com/upload/public/pdf/source/20231030/E912096EFF708041568A0F74B4C79E56.pdf; Supplier: LCSC; Convert to PCB: yes; Type: 分流器; Value: 0.5mΩ; Rated Output Voltage: -; Rated Current: -
R32 R35 R38 = 0603 100Ω (1000) 1%: 贴片电阻; ComponentLink1Description: 供应商链接; ComponentLink1URL: http://www.szlcsc.com/product/details_23502.html; Package: 0603; Supplier: LC; SuppliersPartNumber: C22775
R33 = ERTJ1VG103FA: Manufacturer: PANASONIC(松下); Symbol: ERT-J1VG103FA; Add into BOM: yes; Resistance @ 25℃: 10kΩ; B Constant (25℃/50℃): 3380K; Resistance Tolerance: ±1%; B Constant (25℃/85℃): 3435K; Power: 100mW; Name: ERTJ1VG103FA; Device: ERTJ1VG103FA; LCSC Part Name: 10kΩ 电阻精度:±1% 3380K; Supplier Part: C153011; Manufacturer Part: ERTJ1VG103FA; Supplier Footprint: 0603; JLCPCB Part Class: Extended Part; Datasheet: https://atta.szlcsc.com/upload/public/pdf/source/20180420/C178739_3B90639CA07E4EB840BCF39529957312.pdf; Supplier: LCSC; Convert to PCB: yes; B Constant (25℃/75℃): -; B Constant (25℃/100℃): -; B Constant Tolerance: ±1%; Steady State Current (Max): -; Operating Temperature: -40℃~+125℃
R36 = 0603 10KΩ (1002) 1%: 贴片电阻; ComponentLink1Description: 供应商链接; ComponentLink1URL: http://www.szlcsc.com/product/details_26547.html; Package: 0603; Supplier: LC; SuppliersPartNumber: C25804
U4-U6 = AD8418WBRMZ: Manufacturer: ADI(亚德诺); Add into BOM: yes; Number of Channels: 单路; Supply Current: 2.6mA; Name: AD8418WBRMZ; Symbol: AD8418WBRMZ; Device: AD8418WBRMZ; LCSC Part Name: AD8418WBRMZ; Supplier Part: C207727; Manufacturer Part: AD8418WBRMZ; Supplier Footprint: MSOP-8; JLCPCB Part Class: Extended Part; Datasheet: https://atta.szlcsc.com/upload/public/pdf/source/20200312/C495342_AB22F5CA716828B66C7BAA0F926F15C0.pdf; Supplier: LCSC; Convert to PCB: yes; Operating Temperature: -40℃~+125℃

## Nets that join several sheets
+5: vesc (6 pins), vesc_can (C34.2 U3.3), vesc_drv8301 (8 pins)
GND: vesc (28 pins), vesc_can (C34.1 C35.1 U3.2 U3.8), vesc_mcu (15 pins), vesc_drv8301 (34 pins), vesc_power (29 pins)
VCC: vesc (8 pins), vesc_can (C35.2 U3.5), vesc_mcu (12 pins), vesc_drv8301 (C32.2 C33.2 U2.49 VR1.2), vesc_power (10 pins)
NetC1_1: vesc (C1.1 MX2.5 R4.2), vesc_mcu (U1.24)
NetC2_2: vesc (C2.2 R8.2), vesc_mcu (U1.58)
NetC11_2: vesc (MX7.5), vesc_mcu (C11.2 U1.7)
NetC42_2: vesc_mcu (U1.8), vesc_power (C42.2 R32.1)
NetC43_2: vesc_mcu (U1.9), vesc_power (C43.2 R35.1)
NetC46_2: vesc_mcu (U1.17), vesc_power (C46.2 R33.1 R36.2)
NetC47_2: vesc_mcu (U1.10), vesc_power (C47.2 R38.1)
NetD2_A: vesc (D2.A), vesc_mcu (U1.27)
NetD3_A: vesc (D3.A), vesc_mcu (U1.26)
NetMX1_2: vesc (MX1.2), vesc_can (R25.2 U3.7)
NetMX1_3: vesc (MX1.3), vesc_can (R25.1 U3.6)
NetMX2_2: vesc (MX2.2 R7.2), vesc_mcu (U1.39)
NetMX2_3: vesc (MX2.3 R6.2), vesc_mcu (U1.38)
NetMX2_4: vesc (MX2.4 R5.2), vesc_mcu (U1.37)
NetMX3_4: vesc (MX3.4), vesc_mcu (U1.21)
NetMX3_5: vesc (MX3.5 MX4.4), vesc_mcu (U1.20 U1.30)
NetMX3_6: vesc (MX3.6 MX4.2), vesc_mcu (U1.23 U1.29)
NetMX3_7: vesc (MX3.7), vesc_mcu (U1.22)
NetMX3_8: vesc (MX3.8), vesc_mcu (U1.25)
NetMX5_2: vesc (MX5.2), vesc_mcu (U1.54)
NetMX5_3: vesc (MX5.3), vesc_mcu (U1.55)
NetMX5_4: vesc (MX5.4), vesc_mcu (U1.56)
NetMX5_5: vesc (MX5.5), vesc_mcu (U1.33)
NetMX7_2: vesc (MX7.2), vesc_mcu (U1.49)
NetMX7_4: vesc (MX7.4), vesc_mcu (U1.46)
NetR2_2: vesc (R2.2), vesc_mcu (U1.44)
NetR3_2: vesc (R3.2), vesc_mcu (U1.45)
NetR17_1: vesc_mcu (U1.11), vesc_drv8301 (R17.1 R18.1)
NetR19_1: vesc_mcu (U1.14), vesc_drv8301 (R19.1 R20.1)
NetR21_1: vesc_mcu (U1.15), vesc_drv8301 (R21.1 R22.1)
NetR23_1: vesc_mcu (U1.16), vesc_drv8301 (R23.1 R24.1)
NetR26_1: vesc_drv8301 (U2.47), vesc_power (R26.1)
NetR27_1: vesc_drv8301 (U2.37), vesc_power (R27.1)
NetR28_1: vesc_drv8301 (U2.45), vesc_power (R28.1)
NetR29_1: vesc_drv8301 (U2.35), vesc_power (R29.1)
NetR34_1: vesc_drv8301 (U2.42), vesc_power (R34.1)
NetR37_1: vesc_drv8301 (U2.40), vesc_power (R37.1)
NetU1_34: vesc_mcu (U1.34), vesc_drv8301 (U2.18)
NetU1_35: vesc_mcu (U1.35), vesc_drv8301 (U2.20)
NetU1_36: vesc_mcu (U1.36), vesc_drv8301 (U2.22)
NetU1_40: vesc_mcu (U1.40), vesc_drv8301 (U2.8)
NetU1_41: vesc_mcu (U1.41), vesc_drv8301 (U2.17)
NetU1_42: vesc_mcu (U1.42), vesc_drv8301 (U2.19)
NetU1_43: vesc_mcu (U1.43), vesc_drv8301 (U2.21)
NetU1_51: vesc_mcu (U1.51), vesc_drv8301 (U2.11)
NetU1_52: vesc_mcu (U1.52), vesc_drv8301 (U2.10)
NetU1_53: vesc_mcu (U1.53), vesc_drv8301 (U2.9)
NetU1_57: vesc_mcu (U1.57), vesc_drv8301 (U2.16)
NetU1_59: vesc_mcu (U1.59), vesc_drv8301 (U2.6)
NetU1_61: vesc_can (U3.4), vesc_mcu (U1.61)
NetU1_62: vesc_can (U3.1), vesc_mcu (U1.62)
SH_A: vesc_drv8301 (C19.2 R19.2 U2.46), vesc_power (Q1.3 Q3.4 R30.2 U4.8)
SH_B: vesc_drv8301 (C23.2 R21.2 U2.41), vesc_power (Q5.3 Q6.4 R39.2 U6.8)
SH_C: vesc_drv8301 (C26.2 R23.2 U2.36), vesc_power (Q2.3 Q4.4 R31.2 U5.8)
SUPPLY: vesc (P1.1), vesc_drv8301 (6 pins), vesc_power (12 pins)